# Altium schematic sheet 5_rf_path.SchDoc: RF path selection
size A4; OrganizationName: Pluton UPV; Address1: Universitat Politècnica; Address2: de València (UPV); Address3: Camí de Vera, València; Address4: Spain; SheetNumber: 5; SheetTotal: 8
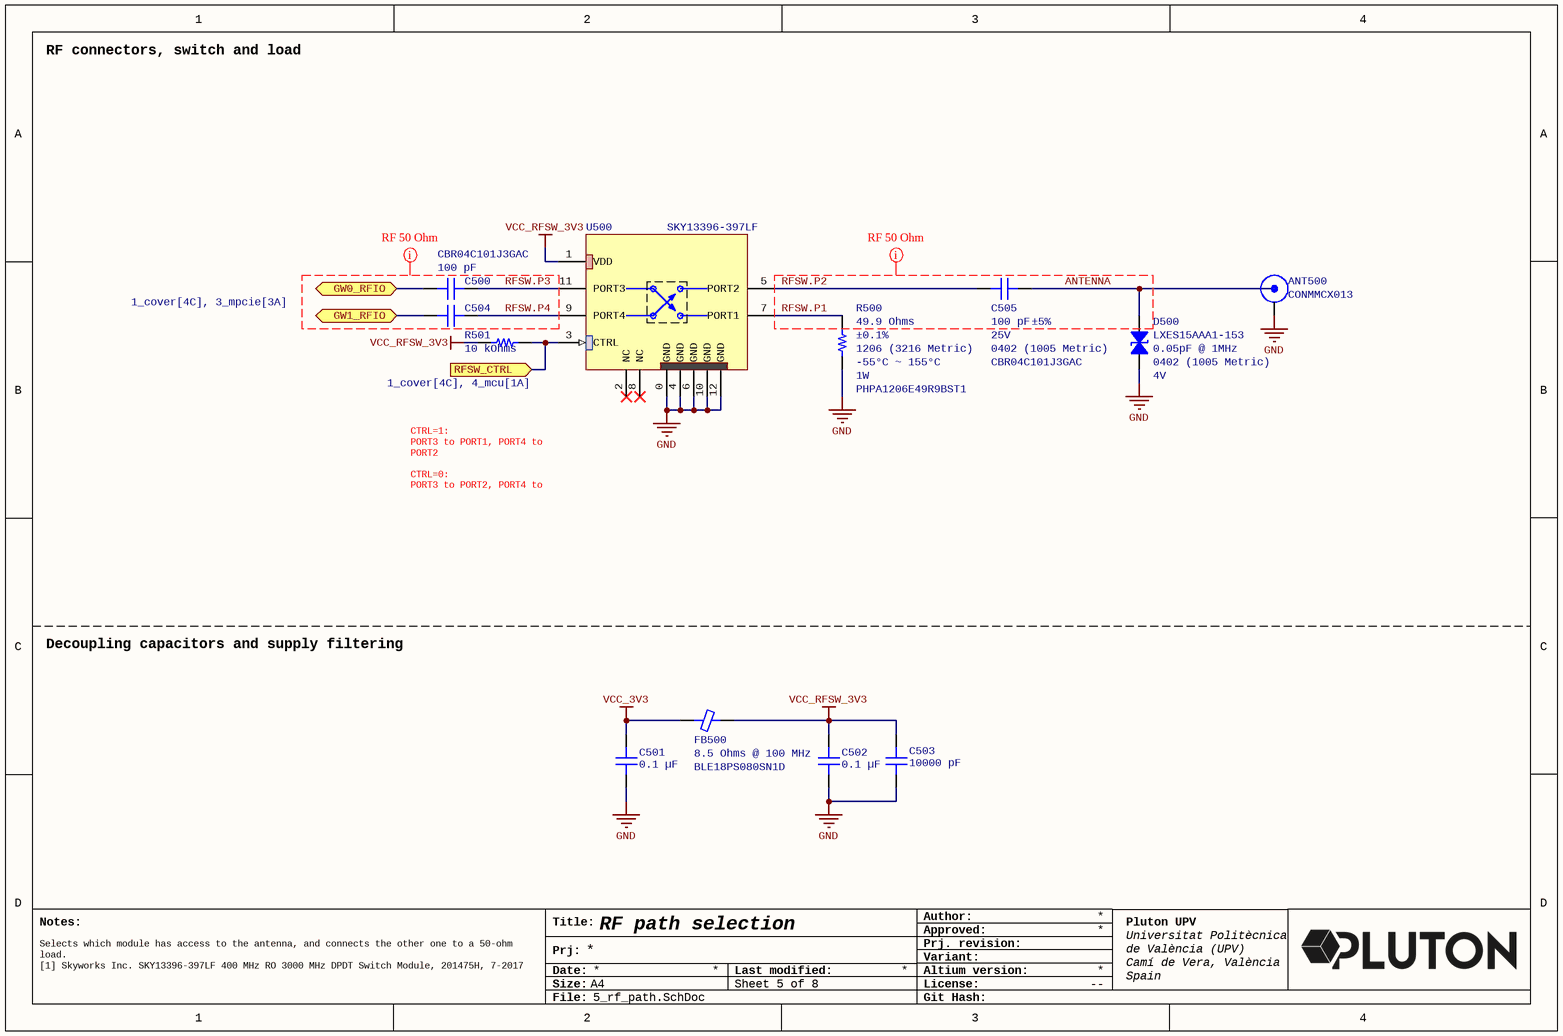
[diagram p0: 5_rf_path.SchDoc]

## Parts
ANT500  CONMMCX013  [CONMMCX013]
C500  Part Number: CBR04C101J3GAC  [CAP 0402_1005 RF]  (hidden comment: 100 pF)
C501  0.1 µF  [CAP 0402_1005]
C502  0.1 µF  [CAP 0402_1005]
C503  10000 pF  [CAP 0402_1005]
C504  100 pF  [CAP 0402_1005 RF]  (value not drawn)
C505  Part Number: CBR04C101J3GAC  Device Package: 0402 (1005 Metric)  Tolerance: ±5%  Voltage - Rated: 25V  [CAP 0402_1005 RF]  (hidden comment: 100 pF)
D500  Capacitance @ Frequency: 0.05pF @ 1MHz  Device Package: 0402 (1005 Metric)  Voltage - Reverse Standoff (Typ): 4V  [0402]  (hidden comment: LXES15AAA1-153)
FB500  Part Number: BLE18PS080SN1D  [FER 0603_1608]  (hidden comment: 8.5 Ohms @ 100 MHz)
R500  49.9 Ohms  Part Number: PHPA1206E49R9BST1  Device Package: 1206 (3216 Metric)  Operating Temperature: -55°C ~ 155°C  Power (Watts): 1W  Tolerance: ±0.1%  [RES 1206_3216]
R501  10 kOhms  [RES 0201_0603]
U500  SKY13396-397LF  [SKY13396-397LF]

## Ports
GW0_RFIO (bidir, see 1_cover[4C], 3_mpcie[1A]), GW1_RFIO (bidir, see 1_cover[4C], 3_mpcie[3A]), RFSW_CTRL (in, see 1_cover[4C], 4_mcu[1A])

## Nets
GND: ANT500.2(GND) C501.1 C502.1 C503.1 D500.1 R500.1 U500.0(GND) U500.4(GND) U500.6(GND) U500.10(GND) U500.12(GND)
VCC_3V3: C501.2 FB500.1
VCC_RFSW_3V3: C502.2 C503.2 FB500.2 R501.2 U500.1(VDD)
ANTENNA: ANT500.1(SIGNAL) C505.2 D500.2
GW0_RFIO: C500.1 ; port GW0_RFIO
GW1_RFIO: C504.1 ; port GW1_RFIO
RFSW.P1: R500.2 U500.7(PORT1)
RFSW.P2: C505.1 U500.5(PORT2)
RFSW.P3: C500.2 U500.11(PORT3)
RFSW.P4: C504.2 U500.9(PORT4)
RFSW_CTRL: R501.1 U500.3(CTRL) ; port RFSW_CTRL

Not connected (* = marked no-connect by the designer): U500 2(NC)* 8(NC)*

## Layout directives
net class RF50; rule Width Constraint [Pref Impedance = 50.00ohms    Min Impedance = 50.00ohms    Max Impedance = 50.00ohms]: ANTENNA, RFSW.P1, RFSW.P2, RFSW.P3, RFSW.P4

## Notes on the sheet
- RF connectors, switch and load
- CTRL=1:
  PORT3 to PORT1, PORT4 to PORT2
  CTRL=0:
  PORT3 to PORT2, PORT4 to PORT1
- Decoupling capacitors and supply filtering
- Selects which module has access to the antenna, and connects the other one to a 50-ohm load.
  [1] Skyworks Inc. SKY13396-397LF 400 MHz RO 3000 MHz DPDT Switch Module, 201475H, 7-2017
- Notes:
- Title:
- Author:
- Approved:
- Date:
- Prj:
- Size:
- A4
- Last modified:
- Altium version:
- Variant:
- Prj. revision:
- License:
- --
- File:
- Git Hash:

## Library data of the parts
ANT500 = MMCX-CONMMCX013: MMCX Jack PCB Cutout Edge Mount Connector 0 to 8.5 GHz operation MMCX (female socket) connection
C500 C504 = CBR04C101J3GAC: CAP CER 100PF 25V C0G/NP0 0402; manufacturer: KEMET; Temperature Coefficient: C0G, NP0; Tolerance: ±5%; Applications: RF, Microwave, High Frequency; Capacitance: 100 pF; componentlink1description: Datasheet; componentlink1url: https://api.kemet.com/component-edge/download/datasheet/CBR04C101J3GAC.pdf; componentlink2description: DigiKey Link; componentlink2url: https://www.digikey.com/en/products/detail/kemet/CBR04C101J3GAC/8572519; Device Package: 0402 (1005 Metric); Features: High Q, Low Loss, Ultra Low ESR; lastupdated: 03/06/2024 19:38:14; Lifecycle Status: Active; Minimum Order: 1; Mounting Type: Surface Mount, MLCC; Operating Temperature: -55°C ~ 125°C; Package / Case: 0402 (1005 Metric); packaging: TapeAndReel; partid: 681; Part Status: Active; price: 0.02; series: CBR-SMD RF C0G; Size / Dimension: 0.039" L x 0.020" W (1.00mm x 0.50mm); Supplier 1: DigiKey; Supplier Part Number 1: 399-17684-1-ND; Thickness (Max): 0.022" (0.55mm); value: 100 pF; Voltage - Rated: 25V
  C504: Part Number: CBR04C101J3GAC
C501 C502 = C0402C104K4RECAUTO: CAP CER 0402 0.1UF 16V X7R 10%; manufacturer: KEMET; Part Number: C0402C104K4RECAUTO; Value: 0.1 µF; Applications: Automotive, ESD Protection; Capacitance: 0.1 µF; componentlink1description: Datasheet; componentlink1url: https://api.kemet.com/component-edge/download/datasheet/C0402C104K4RECAUTO.pdf; componentlink2description: DigiKey Link; componentlink2url: https://www.digikey.com/en/products/detail/kemet/C0402C104K4RECAUTO/8563695; Device Package: 0402 (1005 Metric); lastupdated: 09/02/2024 20:04:38; Lifecycle Status: Active; Minimum Order: 1; Mounting Type: Surface Mount, MLCC; Operating Temperature: -55°C ~ 125°C; Package / Case: 0402 (1005 Metric); packaging: TapeAndReel; partid: 1731; Part Status: Active; price: 0.01; Ratings: AEC-Q200; series: ESD SMD Auto X7R; Size / Dimension: 0.039" L x 0.020" W (1.00mm x 0.50mm); Supplier 1: DigiKey; Supplier Part Number 1: 399-17167-1-ND; Temperature Coefficient: X7R; Thickness (Max): 0.022" (0.55mm); Tolerance: ±10%; Voltage - Rated: 16V
C503 = GRM1555C1E103JE01J: CAP CER 10000PF 25V C0G/NP0 0402; manufacturer: Murata Electronics; Temperature Coefficient: C0G, NP0; Tolerance: ±5%; Part Number: GRM1555C1E103JE01J; Value: 10000 pF; Applications: General Purpose; Capacitance: 10000 pF; componentlink1description: Datasheet; componentlink1url: https://search.murata.co.jp/Ceramy/image/img/A01X/G101/ENG/GRM1555C1E103JE01-01A.pdf; componentlink2description: DigiKey Link; componentlink2url: https://www.digikey.com/en/products/detail/murata-electronics/GRM1555C1E103JE01J/16033801; Device Package: 0402 (1005 Metric); lastupdated: 09/02/2024 20:04:09; Lifecycle Status: Active; Minimum Order: 1; Mounting Type: Surface Mount, MLCC; Operating Temperature: -55°C ~ 125°C; Package / Case: 0402 (1005 Metric); packaging: TapeAndReel; partid: 41084; Part Status: Active; price: 0.02; series: GRM; Size / Dimension: 0.039" L x 0.020" W (1.00mm x 0.50mm); Supplier 1: DigiKey; Supplier Part Number 1: 490-GRM1555C1E103JE01JCT-ND; Thickness (Max): 0.026" (0.65mm); Voltage - Rated: 25V
C505 = CBR04C101J3GAC: CAP CER 100PF 25V C0G/NP0 0402; manufacturer: KEMET; Temperature Coefficient: C0G, NP0; Applications: RF, Microwave, High Frequency; Capacitance: 100 pF; componentlink1description: Datasheet; componentlink1url: https://api.kemet.com/component-edge/download/datasheet/CBR04C101J3GAC.pdf; componentlink2description: DigiKey Link; componentlink2url: https://www.digikey.com/en/products/detail/kemet/CBR04C101J3GAC/8572519; Features: High Q, Low Loss, Ultra Low ESR; lastupdated: 03/06/2024 19:38:14; Lifecycle Status: Active; Minimum Order: 1; Mounting Type: Surface Mount, MLCC; Operating Temperature: -55°C ~ 125°C; Package / Case: 0402 (1005 Metric); packaging: TapeAndReel; partid: 681; Part Status: Active; price: 0.02; series: CBR-SMD RF C0G; Size / Dimension: 0.039" L x 0.020" W (1.00mm x 0.50mm); Supplier 1: DigiKey; Supplier Part Number 1: 399-17684-1-ND; Thickness (Max): 0.022" (0.55mm); value: 100 pF
D500 = LXES15AAA1-153: TVS DIODE 4V 1005; Manufacturer: Murata Electronics; Bidirectional Channels: 1; Power Line Protection: No; Type: Zener; Part Number: LXES15AAA1-153; Applications: General Purpose; ComponentLink1Description: Datasheet; ComponentLink1URL: https://www.murata.com/en-us/products/productdata/8796832759838/CRESD-E.pdf; ComponentLink2Description: DigiKey Link; ComponentLink2URL: http://digikey.com/product-detail/en/murata-electronics/LXES15AAA1-153/490-13210-2-ND/5843762; LastUpdated: 03/06/2024 20:23:00; Lifecycle Status: Active; Minimum Order: 0; Mounting Type: Surface Mount; Operating Temperature: -40°C ~ 85°C (TA); Package / Case: 0402 (1005 Metric); Packaging: TapeAndReel; PartId: 10448; Part Status: Active; Price: 0.04; Series: -; Supplier 1: DigiKey; Supplier Part Number 1: 490-13210-2-ND; Supplier Device Package: 1005
FB500 = BLE18PS080SN1D: FERRITE BEAD 8.5 OHM 0603 1LN; Manufacturer: Murata Electronics; Current Rating (Max): 8A; DC Resistance (DCR) (Max): 4mOhm; Filter Type: Power Line; Number of Lines: 1; ComponentLink1Description: Datasheet; ComponentLink1URL: https://www.murata.com/products/productdata/8800169525278/ENFA0080.pdf; ComponentLink2Description: DigiKey Link; ComponentLink2URL: https://www.digikey.com/en/products/detail/murata-electronics/BLE18PS080SN1D/13904803; Device Package: 0603 (1608 Metric); Height (Max): 0.030" (0.75mm); Impedance @ Frequency: 8.5 Ohms @ 100 MHz; LastUpdated: 03/06/2024 19:51:46; Lifecycle Status: Active; Minimum Order: 1; Mounting Type: Surface Mount; Operating Temperature: -55°C ~ 125°C; Package / Case: 0603 (1608 Metric); Packaging: TapeAndReel; PartId: 2651; Part Status: Active; Price: 0.08; Series: EMIFIL®, BLE18; Size / Dimension: 0.063" L x 0.031" W (1.60mm x 0.80mm); Supplier 1: DigiKey; Supplier Part Number 1: 490-BLE18PS080SN1DCT-ND; Value: 8.5 Ohms @ 100 MHz
R500 = PHPA1206E49R9BST1: THIN FILM RES SMD 49.9 OHM 0.1%; Manufacturer: Vishay Dale Thin Film; Temperature Coefficient: ±25ppm/°C; ComponentLink1Description: Datasheet; ComponentLink1URL: https://www.vishay.com/docs/60160/phpa.pdf; ComponentLink2Description: DigiKey Link; ComponentLink2URL: https://www.digikey.com/en/products/detail/vishay-dale-thin-film/PHPA1206E49R9BST1/14555186; Composition: Thin Film; Features: Anti-Sulfur, Automotive AEC-Q200, High Power, Moisture Resistant; Height - Seated (Max): 0.020" (0.51mm); LastUpdated: 09/02/2024 20:53:25; Lifecycle Status: Active; Minimum Order: 1; Number of Terminations: 2; Package / Case: 1206 (3216 Metric); Packaging: TapeAndReel; PartId: 58771; Part Status: Active; Price: 0.76; Ratings: AEC-Q200; Resistance: 49.9 Ohms; Series: PHPA; Size / Dimension: 0.126" L x 0.063" W (3.20mm x 1.60mm); Supplier 1: DigiKey; Supplier Part Number 1: 764-PHPA1206E49R9BST1CT-ND; Supplier Device Package: 1206; Value: 49.9 Ohms
R501 = AF0201FR-0710KL: RES SMD 10K OHM 1% 1/20W 0201; Manufacturer: Yageo; Power (Watts): 0.05W, 1/20W; Temperature Coefficient: ±200ppm/°C; Part Number: AF0201FR-0710KL; Value: 10 kOhms; ComponentLink1Description: Datasheet; ComponentLink1URL: https://www.yageo.com/upload/media/product/productsearch/datasheet/rchip/PYu-AF_51_RoHS_L_9.pdf; ComponentLink2Description: DigiKey Link; ComponentLink2URL: https://www.digikey.com/en/products/detail/yageo/AF0201FR-0710KL/5900138; Composition: Thick Film; Device Package: 0201 (0603 Metric); Features: Anti-Sulfur, Automotive AEC-Q200; Height - Seated (Max): 0.010" (0.26mm); LastUpdated: 04/06/2024 19:11:47; Lifecycle Status: Active; Minimum Order: 1; Number of Terminations: 2; Operating Temperature: -55°C ~ 125°C; Package / Case: 0201 (0603 Metric); Packaging: TapeAndReel; PartId: 78061; Part Status: Active; Price: 0.01; Ratings: AEC-Q200; Resistance: 10 kOhms; Series: AF; Size / Dimension: 0.024" L x 0.012" W (0.60mm x 0.30mm); Supplier 1: DigiKey; Supplier Part Number 1: 13-AF0201FR-0710KLCT-ND; Supplier Device Package: 0201; Tolerance: ±1%
U500 = SKY13396-397LF: 0.4 to 3.0 GHz DPDT Switch